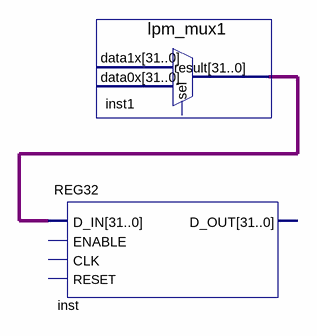
[diagram p0: schematic sheet]
// Quartus schematic MDR_Unit.bdf as structural Verilog: 2 symbols, 0 pins
module MDR_Unit (
);

  wire [31:0] inst1_result;

  lpm_mux1 inst1 (.result(inst1_result));  // open: data1x, data0x, sel
  REG32 inst (.D_IN(inst1_result));  // open: ENABLE, CLK, RESET, D_OUT
endmodule
